# EAGLE schematic Main board V5.0 (EAGLE 6.5.0)

## Sheet 1 of 7: ACS
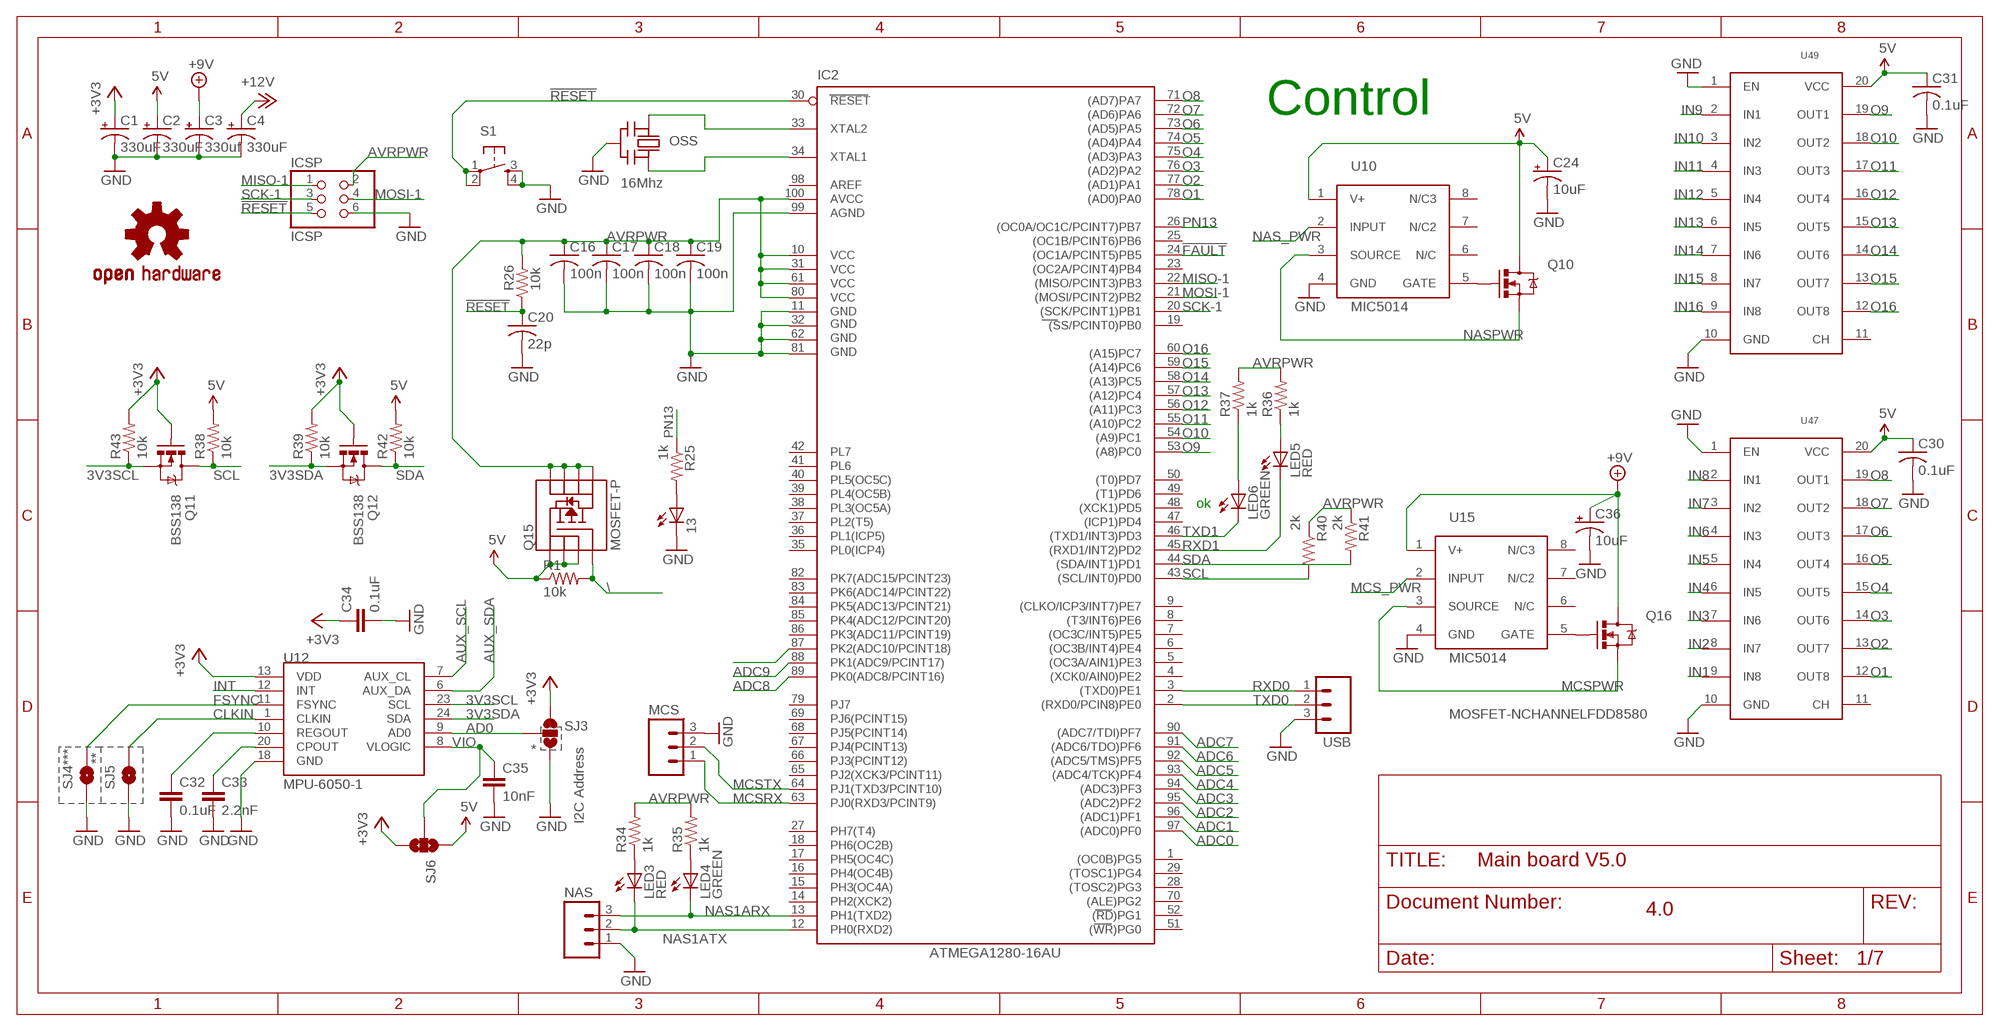
[diagram p0: schematic, sheet 1]

### Parts
13  LEDCHIP-LED0805  [CHIP-LED0805]
C1  330uF  CPOL-US140CLH-0810  [140CLH-0810]
C2  330uF  CPOL-US140CLH-0810  [140CLH-0810]
C3  330uf  CPOL-US140CLH-0810  [140CLH-0810]
C4  330uF  CPOL-US140CLH-0810  [140CLH-0810]
C16  100n  C-USC0805  [C0805]
C17  100n  C-USC0805  [C0805]
C18  100n  C-USC0805  [C0805]
C19  100n  C-USC0805  [C0805]
C20  22p  C-USC0805  [C0805]
C24  10uF  CPOL-USCT6032  [CT6032]
C30  0.1uF  C-USC0805  [C0805]
C31  0.1uF  C-USC0805  [C0805]
C32  0.1uF  CAP0805  [0805]
C33  2.2nF  CAP0805  [0805]
C34  0.1uF  CAP0805  [0805]
C35  10nF  CAP0805  [0805]
C36  10uF  CPOL-USCT6032  [CT6032]
IC2  ATMEGA1280-16AU  [TQFP100]
ICSP  ICSP  PINHD-2X3  [2X03]
LED3  RED  LEDCHIP-LED0805  [CHIP-LED0805]
LED4  GREEN  LEDCHIP-LED0805  [CHIP-LED0805]
LED5  RED  LEDCHIP-LED0805  [CHIP-LED0805]
LED6  GREEN  LEDCHIP-LED0805  [CHIP-LED0805]
MCS  M03LOCK  [1X03_LOCK]
NAS  M03POLAR  [MOLEX-1X3]
OSS  16Mhz  CERMOSCILL-AWCSR  [AWCSR]
Q10  MOSFET-NCHANNELFDD8580  [DPAK]
Q11  BSS138  MOSFET-NCHANNELSMD  [SOT23-3]
Q12  BSS138  MOSFET-NCHANNELSMD  [SOT23-3]
Q15  MOSFET-P  MOSFET-PCHANNEL-SOIC8SOIC8  [SO08]
Q16  MOSFET-NCHANNELFDD8580  [DPAK]
R1  10k  R-US_R0805  [R0805]
R25  1k  R-US_R0805  [R0805]
R26  10k  R-US_R0805  [R0805]
R34  1k  R-US_R0805  [R0805]
R35  1k  R-US_R0805  [R0805]
R36  1k  R-US_R0805  [R0805]
R37  1k  R-US_R0805  [R0805]
R38  10k  R-US_R0805  [R0805]
R39  10k  R-US_R0805  [R0805]
R40  2k  R-US_R0805  [R0805]
R41  2k  R-US_R0805  [R0805]
R42  10k  R-US_R0805  [R0805]
R43  10k  R-US_R0805  [R0805]
S1  TAC_SWITCHSMD  [TACTILE_SWITCH_SMD]
SJ3  SOLDERJUMPER_2WAYPASTE2&3  [SJ_3_PASTE2&3]
SJ4  SOLDERJUMPERTRACE  [SJ_2S-TRACE]
SJ5  SOLDERJUMPERTRACE  [SJ_2S-TRACE]
SJ6  SOLDERJUMPER_2WAYPASTE2&3  [SJ_3_PASTE2&3]
U10  MIC5014  [SO08]
U12  MPU-6050-1  [QFN-24-4MM2]
U15  MIC5014  [SO08]
U47  MAX6818  [SSOP-20]
U49  MAX6818  [SSOP-20]
U$3  OSHW-LOGOL  [OSHW-LOGO-L]
USB  M03LOCK  [1X03_LOCK]

### Nets
3V3SCL: Q11.2(S) R43.1 U12.23(SCL)
3V3SDA: Q12.2(S) R39.1 U12.24(SDA)
5V: C2.+ C24.+ C30.1 C31.1 Q10.4(D) Q15.1(S) Q15.2(S) Q15.3(S) R1.1 R38.2 R42.2 SJ6.1 U10.1(V+) U47.20(VCC) U49.20(VCC) ; also sheet 2,3,4,7
!FAULT: IC2.24((OC1A/PCINT5)PB5)
!RESET: C20.1 IC2.30(RESET) ICSP.5 R26.1 S1.1 S1.2
+3V3: C1.+ C34.1 Q11.1(G) Q12.1(G) R39.2 R43.2 SJ3.1 SJ6.3 U12.13(VDD) ; also sheet 4,6,7
+9V: C3.+ C36.+ Q16.4(D) U15.1(V+) ; also sheet 7
+12V: C4.+ ; also sheet 2,7
\: Q15.4(G) R1.2 ; also sheet 3
AD0: SJ3.2 U12.9(AD0)
ADC0: IC2.97((ADC0)PF0) ; also sheet 7
ADC1: IC2.96((ADC1)PF1) ; also sheet 7
ADC2: IC2.95((ADC2)PF2) ; also sheet 7
ADC3: IC2.94((ADC3)PF3) ; also sheet 7
ADC4: IC2.93((ADC4/TCK)PF4) ; also sheet 7
ADC5: IC2.92((ADC5/TMS)PF5) ; also sheet 7
ADC6: IC2.91((ADC6/TDO)PF6) ; also sheet 7
ADC7: IC2.90((ADC7/TDI)PF7) ; also sheet 7
ADC8: IC2.89(PK0(ADC8/PCINT16)) ; also sheet 7
ADC9: IC2.88(PK1(ADC9/PCINT17)) ; also sheet 7
AUX_SCL: U12.7(AUX_CL)
AUX_SDA: U12.6(AUX_DA)
AVRPWR: C16.1 C17.1 C18.1 C19.1 IC2.10(VCC) IC2.31(VCC1) IC2.61(VCC2) IC2.80(VCC3) IC2.100(AVCC) ICSP.2 Q15.5(D) Q15.6(D) Q15.7(D) Q15.8(D) R26.2 R34.2 R35.2 R36.2 R37.2 R40.1 R41.1
CLKIN: SJ5.2 U12.1(CLKIN)
FSYNC: SJ4.2 U12.11(FSYNC)
GND: 13.C C1.- C2.- C3.- C4.- C16.2 C17.2 C18.2 C19.2 C20.2 C24.- C30.2 C31.2 C32.2 C33.2 C34.2 C35.2 C36.- IC2.11(GND) IC2.32(GND1) IC2.62(GND2) IC2.81(GND3) IC2.99(AGND) ICSP.6 MCS.3 NAS.1 OSS.2(GND) S1.3 S1.4 SJ3.3 SJ4.1 SJ5.1 U10.4(GND) U12.18(GND) U15.4(GND) U47.1(EN) U47.10(GND) U49.1(EN) U49.10(GND) USB.3 ; also sheet 2,3,4,6,7
IN1: U47.9(IN8) ; also sheet 7
IN2: U47.8(IN7) ; also sheet 7
IN3: U47.7(IN6) ; also sheet 7
IN4: U47.6(IN5) ; also sheet 7
IN5: U47.5(IN4) ; also sheet 7
IN6: U47.4(IN3) ; also sheet 7
IN7: U47.3(IN2) ; also sheet 7
IN8: U47.2(IN1) ; also sheet 7
IN9: U49.2(IN1) ; also sheet 7
IN10: U49.3(IN2) ; also sheet 7
IN11: U49.4(IN3) ; also sheet 7
IN12: U49.5(IN4) ; also sheet 7
IN13: U49.6(IN5) ; also sheet 7
IN14: U49.7(IN6) ; also sheet 7
IN15: U49.8(IN7) ; also sheet 7
IN16: U49.9(IN8) ; also sheet 7
INT: U12.12(INT)
MCS_PWR: U15.2(INPUT) ; also sheet 3
MCSPWR: Q16.3(S) U15.3(SOURCE) ; also sheet 7
MCSRX: IC2.63(PJ0(RXD3/PCINT9)) MCS.1 ; also sheet 5,7
MCSTX: IC2.64(PJ1(TXD3/PCINT10)) MCS.2 ; also sheet 5,7
MISO-1: IC2.22((MISO/PCINT3)PB3) ICSP.1
MOSI-1: IC2.21((MOSI/PCINT2)PB2) ICSP.4
N$2: 13.A R25.2
N$6: IC2.34(XTAL1) OSS.3(OUT)
N$7: IC2.33(XTAL2) OSS.1(IN)
N$13: C33.1 U12.20(CPOUT)
N$14: C32.1 U12.10(REGOUT)
N$20: IC2.87(PK2(ADC10/PCINT18))
N$52: Q10.1(G) U10.5(GATE)
N$69: LED4.A R35.1
N$71: LED3.A R34.1
N$74: LED6.A R37.1
N$75: LED5.A R36.1
N$107: Q16.1(G) U15.5(GATE)
NAS1ARX: IC2.13(PH1(TXD2)) LED4.C NAS.3 ; also sheet 4
NAS1ATX: IC2.12(PH0(RXD2)) LED3.C NAS.2 ; also sheet 4
NAS_PWR: U10.2(INPUT) ; also sheet 3
NASPWR: Q10.3(S) U10.3(SOURCE) ; also sheet 7
O1: IC2.78((AD0)PA0) U47.12(OUT8)
O2: IC2.77((AD1)PA1) U47.13(OUT7)
O3: IC2.76((AD2)PA2) U47.14(OUT6)
O4: IC2.75((AD3)PA3) U47.15(OUT5)
O5: IC2.74((AD4)PA4) U47.16(OUT4)
O6: IC2.73((AD5)PA5) U47.17(OUT3)
O7: IC2.72((AD6)PA6) U47.18(OUT2)
O8: IC2.71((AD7)PA7) U47.19(OUT1)
O9: IC2.53((A8)PC0) U49.19(OUT1)
O10: IC2.54((A9)PC1) U49.18(OUT2)
O11: IC2.55((A10)PC2) U49.17(OUT3)
O12: IC2.56((A11)PC3) U49.16(OUT4)
O13: IC2.57((A12)PC4) U49.15(OUT5)
O14: IC2.58((A13)PC5) U49.14(OUT6)
O15: IC2.59((A14)PC6) U49.13(OUT7)
O16: IC2.60((A15)PC7) U49.12(OUT8)
PN13: IC2.26((OC0A/OC1C/PCINT7)PB7) R25.1 ; also sheet 3
RXD0: IC2.3((TXD0)PE1) USB.1
RXD1: IC2.45((RXD1/INT2)PD2) LED5.C ; also sheet 4
SCK-1: IC2.20((SCK/PCINT1)PB1) ICSP.3
SCL: IC2.43((SCL/INT0)PD0) Q11.3(D) R38.1 R40.2 ; also sheet 2
SDA: IC2.44((SDA/INT1)PD1) Q12.3(D) R41.2 R42.1 ; also sheet 2
TXD0: IC2.2((RXD0/PCIN8)PE0) USB.2
TXD1: IC2.46((TXD1/INT3)PD3) LED6.C ; also sheet 4
VIO: C35.1 SJ6.2 U12.8(VLOGIC)
Unconnected: IC2.1((OC0B)PG5) IC2.4((XCK0/AIN0)PE2) IC2.5((OC3A/AIN1)PE3) IC2.6((OC3B/INT4)PE4) IC2.7((OC3C/INT5)PE5) IC2.8((T3/INT6)PE6) IC2.9((CLKO/ICP3/INT7)PE7) IC2.14(PH2(XCK2)) IC2.15(PH3(OC4A)) IC2.16(PH4(OC4B)) IC2.17(PH5(OC4C)) IC2.18(PH6(OC2B)) IC2.19((SS/PCINT0)PB0) IC2.23((OC2A/PCINT4)PB4) IC2.25((OC1B/PCINT6)PB6) IC2.27(PH7(T4)) IC2.28((TOSC2)PG3) IC2.29((TOSC1)PG4) IC2.35(PL0(ICP4)) IC2.36(PL1(ICP5)) IC2.37(PL2(T5)) IC2.38(PL3(OC5A)) IC2.39(PL4(OC5B)) IC2.40(PL5(OC5C)) IC2.41(PL6) IC2.42(PL7) IC2.47((ICP1)PD4) IC2.48((XCK1)PD5) IC2.49((T1)PD6) IC2.50((T0)PD7) IC2.51((WR)PG0) IC2.52((RD)PG1) IC2.65(PJ2(XCK3/PCINT11)) IC2.66(PJ3(PCINT12)) IC2.67(PJ4(PCINT13)) IC2.68(PJ5(PCINT14)) IC2.69(PJ6(PCINT15)) IC2.70((ALE)PG2) IC2.79(PJ7) IC2.82(PK7(ADC15/PCINT23)) IC2.83(PK6(ADC14/PCINT22)) IC2.84(PK5(ADC13/PCINT21)) IC2.85(PK4(ADC12/PCINT20)) IC2.86(PK3(ADC11/PCINT19)) IC2.98(AREF) U10.6(N/C) U10.7(N/C2) U10.8(N/C3) U15.6(N/C) U15.7(N/C2) U15.8(N/C3) U47.11(CH) U49.11(CH)

### Notes on the sheet
- Control
- ok
- * | I2C Address
- *** | **
- 4.0

## Sheet 2 of 7: LCS
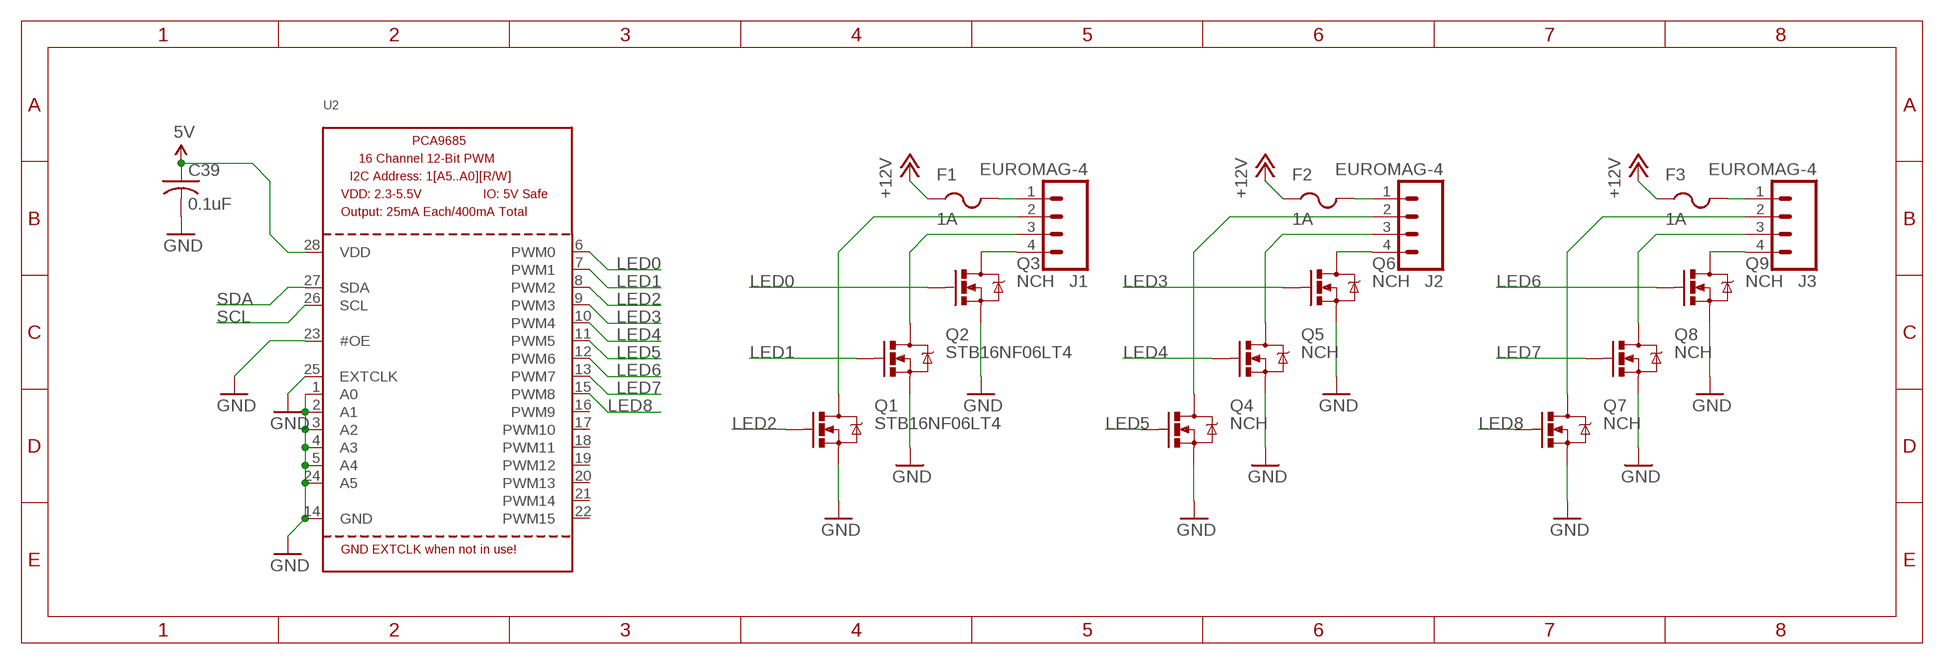
[diagram p1: schematic, sheet 2]

### Parts
C39  0.1uF  C-USC0603  [C0603]
F1  1A  PTCFUSE-1812  [1812]
F2  1A  PTCFUSE-1812  [1812]
F3  1A  PTCFUSE-1812  [1812]
J1  EUROMAG-4  [M4]
J2  EUROMAG-4  [M4]
J3  EUROMAG-4  [M4]
Q1  STB16NF06LT4  MOSFET-NCHANNELFDD8580  [DPAK]
Q2  STB16NF06LT4  MOSFET-NCHANNELFDD8580  [DPAK]
Q3  NCH  MOSFET-NCHANNELFDD8580  [DPAK]
Q4  NCH  MOSFET-NCHANNELFDD8580  [DPAK]
Q5  NCH  MOSFET-NCHANNELFDD8580  [DPAK]
Q6  NCH  MOSFET-NCHANNELFDD8580  [DPAK]
Q7  NCH  MOSFET-NCHANNELFDD8580  [DPAK]
Q8  NCH  MOSFET-NCHANNELFDD8580  [DPAK]
Q9  NCH  MOSFET-NCHANNELFDD8580  [DPAK]
U2  PCA9685  [TSSOP28]

### Nets
5V: C39.1 U2.28(VDD) ; also sheet 1,3,4,7
+12V: F1.1 F2.1 F3.1 ; also sheet 1,7
GND: C39.2 Q1.3(S) Q2.3(S) Q3.3(S) Q4.3(S) Q5.3(S) Q6.3(S) Q7.3(S) Q8.3(S) Q9.3(S) U2.1(A0) U2.2(A1) U2.3(A2) U2.4(A3) U2.5(A4) U2.14(GND) U2.23(#OE) U2.24(A5) U2.25(EXTCLK) ; also sheet 1,3,4,6,7
LED0: Q3.1(G) U2.6(PWM0)
LED1: Q2.1(G) U2.7(PWM1)
LED2: Q1.1(G) U2.8(PWM2)
LED3: Q6.1(G) U2.9(PWM3)
LED4: Q5.1(G) U2.10(PWM4)
LED5: Q4.1(G) U2.11(PWM5)
LED6: Q9.1(G) U2.12(PWM6)
LED7: Q8.1(G) U2.13(PWM7)
LED8: Q7.1(G) U2.15(PWM8)
N$22: J1.4 Q3.4(D)
N$28: J1.3 Q2.4(D)
N$29: J1.2 Q1.4(D)
N$30: F1.2 J1.1
N$31: J2.4 Q6.4(D)
N$32: J2.3 Q5.4(D)
N$34: J2.2 Q4.4(D)
N$35: F2.2 J2.1
N$36: J3.4 Q9.4(D)
N$37: J3.3 Q8.4(D)
N$38: J3.2 Q7.4(D)
N$39: F3.2 J3.1
SCL: U2.26(SCL) ; also sheet 1
SDA: U2.27(SDA) ; also sheet 1
Unconnected: U2.16(PWM9) U2.17(PWM10) U2.18(PWM11) U2.19(PWM12) U2.20(PWM13) U2.21(PWM14) U2.22(PWM15)

## Sheet 3 of 7: WDS
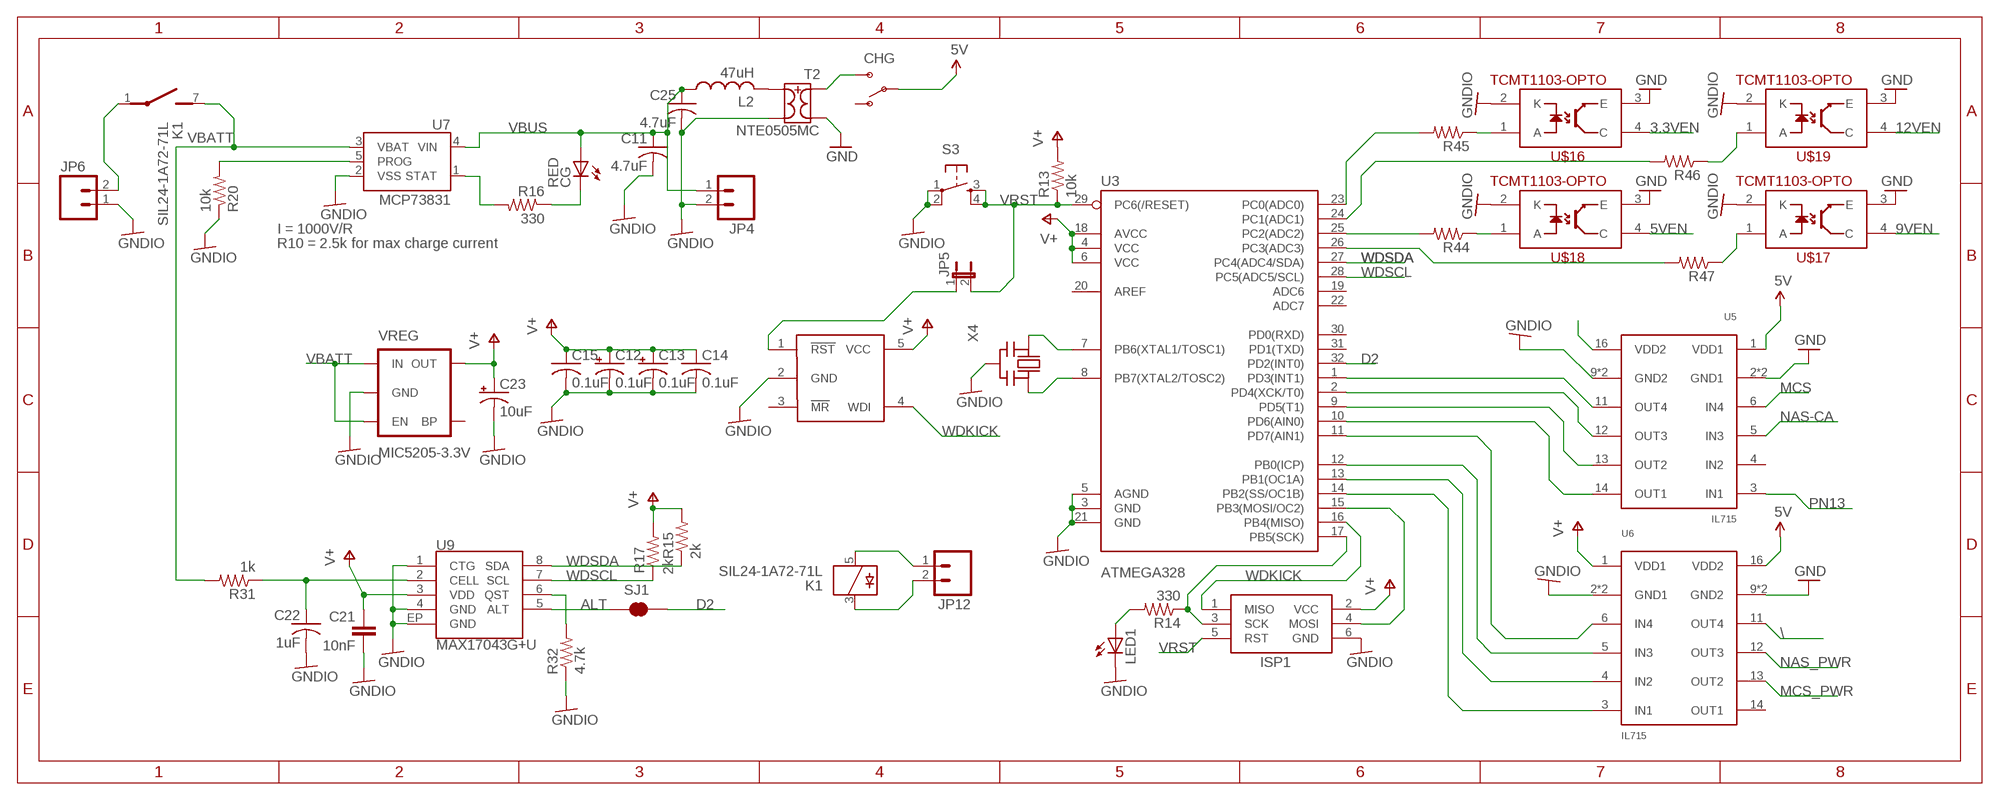
[diagram p2: schematic, sheet 3]

### Parts
C11  4.7uF  C-USC0603  [C0603]
C12  0.1uF  CPOL-USCT3528  [CT3528]
C13  0.1uF  CPOL-USCT3528  [CT3528]
C14  0.1uF  C-USC0805  [C0805]
C15  0.1uF  C-USC0805  [C0805]
C21  10nF  CAP0603-CAP  [0603-CAP]
C22  1uF  C-USC0603  [C0603]
C23  10uF  CPOL-USCT3528  [CT3528]
C25  4.7uF  C-USC0603  [C0603]
CG  RED  LEDSML0805  [SML0805]
CHG  SWITCH-SPSTPTH  [SWITCH-SPDT]
ISP1  AVRISP-6  [AVRISP]
JP4  M021X02_NO_SILK  [1X02_NO_SILK]
JP5  JUMPER-2PTH_LOCK  [1X02_LOCK]
JP6  M02-JST-2MM-SMT  [JST-2-SMD]
JP12  M02POLAR_LOCK  [MOLEX-1X2_LOCK]
K1  SIL24-1A72-71L  35701331  [REED]
L2  47uH  L-USL2012C  [L2012C]
LED1  LEDCHIPLED_0805  [CHIPLED_0805]
R13  10k  R-US_R0805  [R0805]
R14  330  R-US_R0805  [R0805]
R15  2k  R-US_R0805  [R0805]
R16  330  R-US_R0805  [R0805]
R17  2k  R-US_R0805  [R0805]
R20  10k  R-US_R0805  [R0805]
R31  1k  R-US_R0805  [R0805]
R32  4.7k  R-US_R0805  [R0805]
R44  R-US_R0805  [R0805]
R45  R-US_R0805  [R0805]
R46  R-US_R0805  [R0805]
R47  R-US_R0805  [R0805]
S3  TAC_SWITCHPTH  [TACTILE-PTH]
SJ1  SOLDERJUMPERTRACE  [SJ_2S-TRACE]
T2  NTE0505MC  [SO-8FT]
U3  ATMEGA328  ATMEGA168  [TQFP32-08]
U5  IL715  [S016]
U6  IL715  [S016]
U7  MCP73831  [SOT23-5]
U9  MAX17043G+U  MAX1704X  [TDFN-8]
U20  MAX823  [SOT23-5L]
U$16  TCMT1103-OPTO  [SSOP-4]
U$17  TCMT1103-OPTO  [SSOP-4]
U$18  TCMT1103-OPTO  [SSOP-4]
U$19  TCMT1103-OPTO  [SSOP-4]
VREG  MIC5205-3.3V  V_REG_LDOSMD  [SOT23-5]
X4  CERMOSCILL-AWCSR  [AWCSR]

### Nets
3.3VEN: U$16.4(C) ; also sheet 7
5V: CHG.2(P) U5.1(VDD1) U6.16(VDD2) ; also sheet 1,2,4,7
5VEN: U$18.4(C) ; also sheet 7
9VEN: U$17.4(C) ; also sheet 7
12VEN: U$19.4(C) ; also sheet 7
\: U6.11(OUT4) ; also sheet 1
ALT: SJ1.1 U9.5(ALT)
CELL: C22.1 R31.1 U9.2(CELL)
D2: SJ1.2 U3.32(PD2(INT0))
GND: T2.1 U5.2(GND1) U5.8(GND1) U6.9(GND2) U6.15(GND2) U$16.3(E) U$17.3(E) U$18.3(E) U$19.3(E) ; also sheet 1,2,4,6,7
GNDIO: C11.2 C12.- C13.- C14.2 C15.2 C21.2 C22.2 C23.- C25.2 ISP1.6(GND) JP4.2 JP6.1 LED1.C R20.1 R32.1 S3.1 S3.2 T2.7 U3.3(GND) U3.5(AGND) U3.21(GND) U5.9(GND2) U5.15(GND2) U6.2(GND1) U6.8(GND1) U7.2(VSS) U9.1(CTG) U9.4(GND) U9.EP(GND) U20.2(GND) U$16.2(K) U$17.2(K) U$18.2(K) U$19.2(K) VREG.2(GND) X4.2(GND)
MCS: U5.6(IN4) ; also sheet 7
MCS_PWR: U6.13(OUT2) ; also sheet 1
N$18: JP5.1 U20.1(!RST)
N$19: ISP1.3(SCK) R14.1 U3.17(PB5(SCK))
N$27: ISP1.4(MOSI) U3.15(PB3(MOSI/OC2))
N$33: R45.2 U3.23(PC0(ADC0))
N$40: L2.2 T2.8
N$42: LED1.A R14.2
N$44: CG.C R16.1
N$45: JP12.1 K1.5
N$46: JP6.2 K1.1(2:P)
N$47: U3.7(PB6(XTAL1/TOSC1)) X4.1(IN)
N$48: U3.8(PB7(XTAL2/TOSC2)) X4.3(OUT)
N$49: U3.2(PD4(XCK/T0)) U5.12(OUT3)
N$50: U3.9(PD5(T1)) U5.13(OUT2)
N$51: U3.10(PD6(AIN0)) U5.14(OUT1)
N$59: CHG.3(S) T2.3
N$72: U3.11(PD7(AIN1)) U6.6(IN4)
N$76: U3.1(PD3(INT1)) U5.11(OUT4)
N$77: R45.1 U$16.1(A)
N$78: R46.2 U3.24(PC1(ADC1))
N$79: U3.12(PB0(ICP)) U6.5(IN3)
N$80: U3.13(PB1(OC1A)) U6.4(IN2)
N$81: U3.14(PB2(SS/OC1B)) U6.3(IN1)
N$82: R46.1 U$19.1(A)
N$83: R44.2 U3.25(PC2(ADC2))
N$84: R44.1 U$18.1(A)
N$85: R47.2 U3.26(PC3(ADC3))
N$86: R47.1 U$17.1(A)
N$91: JP12.2 K1.3
N$94: U5.16(VDD2)
NAS-CA: U5.5(IN3) ; also sheet 7
NAS_PWR: U6.12(OUT3) ; also sheet 1
PN13: U5.3(IN1) ; also sheet 1
PROG: R20.2 U7.5(PROG)
QST: R32.2 U9.6(QST)
STAT: R16.2 U7.1(STAT)
V+: C12.+ C13.+ C14.1 C15.1 C21.1 C23.+ ISP1.2(VCC) R13.2 R15.2 R17.2 U3.4(VCC) U3.6(VCC) U3.18(AVCC) U6.1(VDD1) U9.3(VDD) U20.5(VCC) VREG.5(OUT)
VBATT: K1.7(2:S) R31.2 U7.3(VBAT) VREG.1(IN) VREG.3(EN)
VBUS: C11.1 C25.1 CG.A JP4.1 L2.1 U7.4(VIN)
VRST: ISP1.5(RST) JP5.2 R13.1 S3.3 S3.4 U3.29(PC6(/RESET))
WDKICK: ISP1.1(MISO) U3.16(PB4(MISO)) U20.4(WDI)
WDSCL: R17.1 U3.28(PC5(ADC5/SCL)) U9.7(SCL)
WDSDA: R15.1 U3.27(PC4(ADC4/SDA)) U9.8(SDA)
Unconnected: CHG.1(O) U3.19(ADC6) U3.20(AREF) U3.22(ADC7) U3.30(PD0(RXD)) U3.31(PD1(TXD)) U5.4(IN2) U6.14(OUT1) U20.3(!MR) VREG.4(BP)

### Notes on the sheet
- I = 1000V/R
- R10 = 2.5k for max charge current

## Sheet 4 of 7: CTS
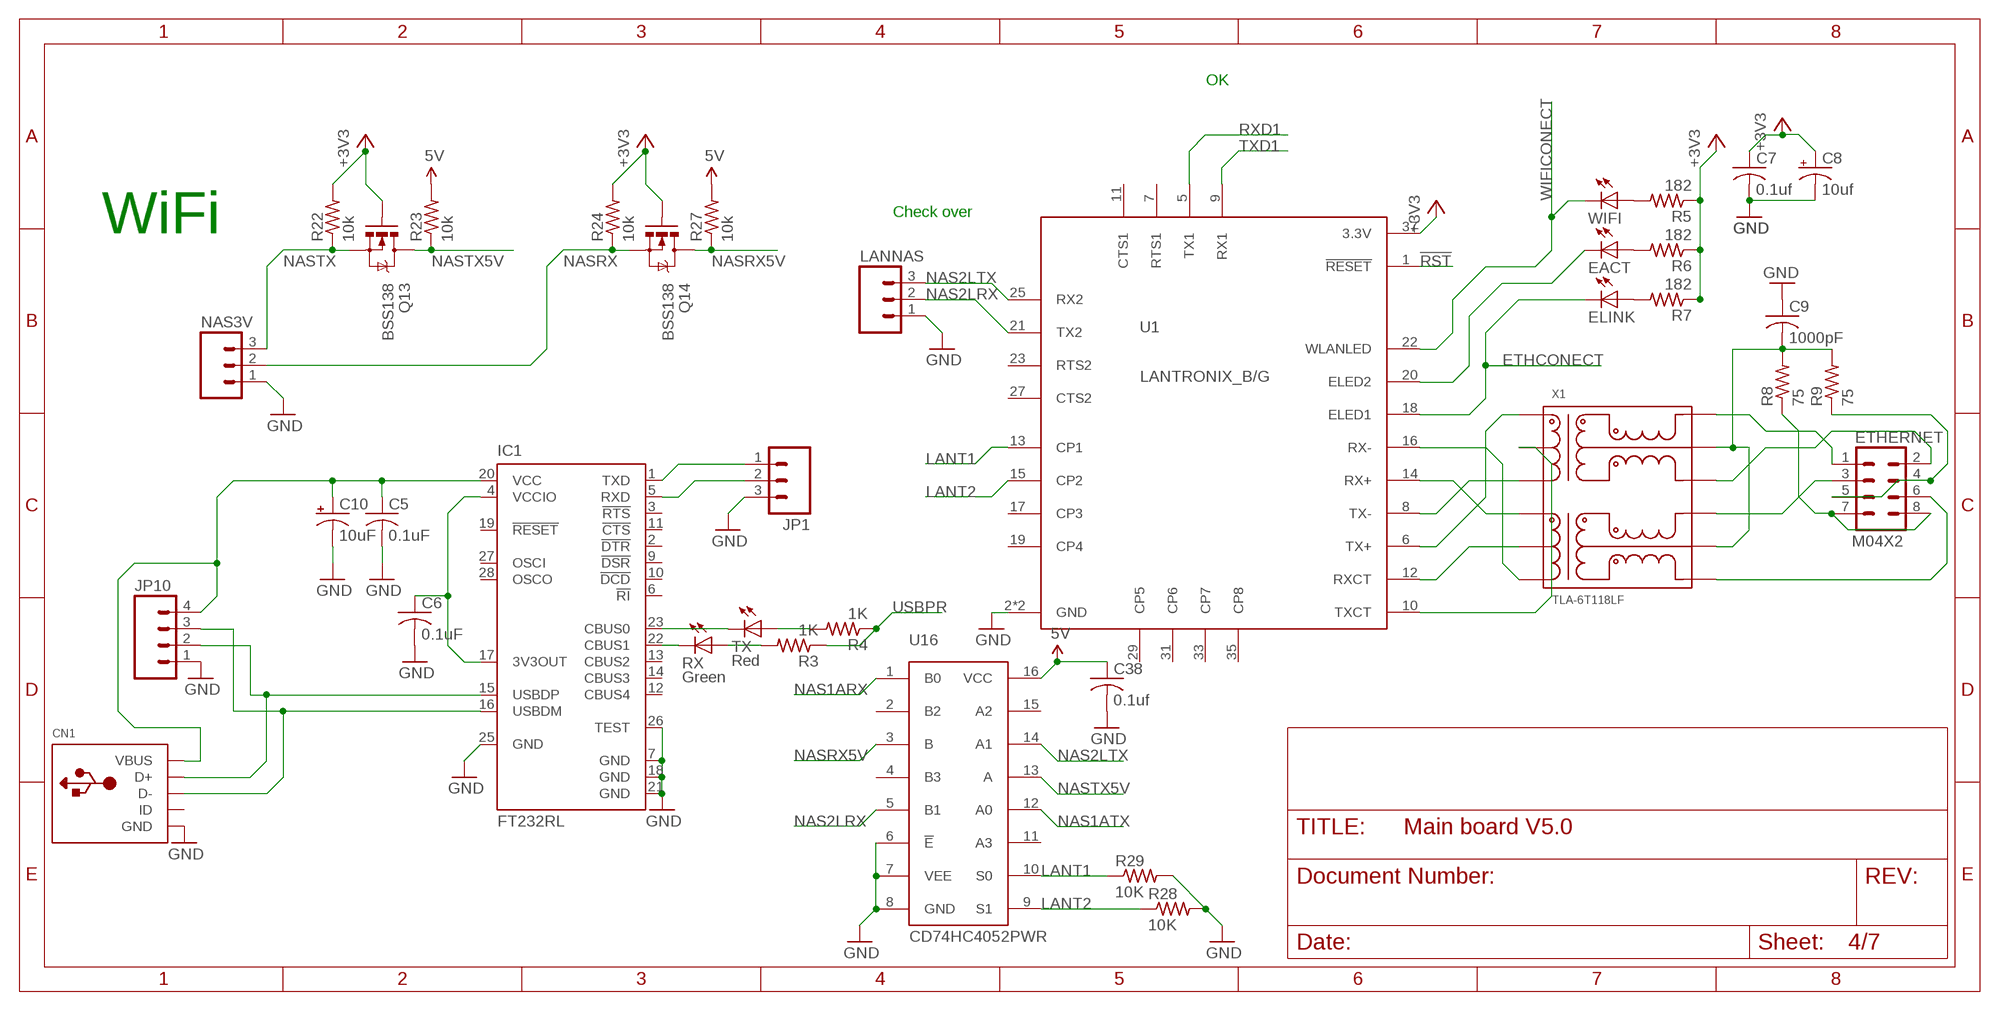
[diagram p3: schematic, sheet 4]

### Parts
C5  0.1uF  C-USC0805K  [C0805K]
C6  0.1uF  C-USC0805K  [C0805K]
C7  0.1uf  C-USC0805K  [C0805K]
C8  10uf  CAP_POL3528  [EIA3528]
C9  1000pF  C-USC1812  [C1812]
C10  10uF  CAP_POL3528-KIT  [EIA3528-KIT]
C38  0.1uf  C-USC0805K  [C0805K]
CN1  USBMINIB  [USB-MINIB]
EACT  LEDCHIP-LED0805  [CHIP-LED0805]
ELINK  LEDCHIP-LED0805  [CHIP-LED0805]
ETHERNET  M04X2  [2X4]
IC1  FT232RL  [SSOP28]
JP1  M03POLAR  [MOLEX-1X3]
JP10  M04POLAR  [MOLEX-1X4]
LANNAS  M03POLAR  [MOLEX-1X3]
NAS3V  M03LOCK_NO_SILK  [1X03_LOCK_NO_SILK]
Q13  BSS138  MOSFET-NCHANNELSMD  [SOT23-3]
Q14  BSS138  MOSFET-NCHANNELSMD  [SOT23-3]
R3  1K  R-US_R0805  [R0805]
R4  1K  R-US_R0805  [R0805]
R5  182  R-US_R0805  [R0805]
R6  182  R-US_R0805  [R0805]
R7  182  R-US_R0805  [R0805]
R8  75  R-US_R0805  [R0805]
R9  75  R-US_R0805  [R0805]
R22  10k  R-US_R0805  [R0805]
R23  10k  R-US_R0805  [R0805]
R24  10k  R-US_R0805  [R0805]
R27  10k  R-US_R0805  [R0805]
R28  10K  R-US_R0805  [R0805]
R29  10K  R-US_R0805  [R0805]
RX  Green  LEDCHIP-LED0805  [CHIP-LED0805]
TX  Red  LEDCHIP-LED0805  [CHIP-LED0805]
U1  LANTRONIX_B/G  LANTRONIX_A/B  [LANA/BTH]
U16  CD74HC4052PWR  [TSSOP-16]
WIFI  LEDCHIP-LED0805  [CHIP-LED0805]
X1  TLA-6T118LF  [SO-16MOD]

### Nets
5V: C38.1 R23.2 R27.2 U16.16(VCC) ; also sheet 1,2,3,7
!RST: U1.1(!RESET)
+3V3: C7.1 C8.A(+) Q13.1(G) Q14.1(G) R5.1 R6.1 R7.1 R22.2 R24.2 U1.37(3.3V) ; also sheet 1,6,7
ETHCONECT: ELINK.C U1.18(ELED1)
GND: C5.2 C6.2 C7.2 C8.C(-) C9.1 C10.C(-) C38.2 CN1.GND IC1.7(GND) IC1.18(GND) IC1.21(GND) IC1.25(GND) IC1.26(TEST) JP1.3 JP10.1 LANNAS.1 NAS3V.1 R28.2 R29.2 U1.2(GND) U1.39(GND) U16.6(!E) U16.7(VEE) U16.8(GND) ; also sheet 1,2,3,6,7
LANT1: R29.1 U1.13(CP1) U16.10(S0)
LANT2: R28.1 U1.15(CP2) U16.9(S1)
N$1: IC1.23(CBUS0) TX.C
N$3: IC1.22(CBUS1) RX.C
N$4: R3.2 RX.A
N$5: CN1.D+ IC1.15(USBDP) JP10.2
N$8: CN1.D- IC1.16(USBDM) JP10.3
N$9: R4.2 TX.A
N$11: IC1.1(TXD) JP1.1
N$12: C6.1 IC1.4(VCCIO) IC1.17(3V3OUT)
N$53: U1.8(TX-) X1.3
N$54: U1.6(TX+) X1.1
N$55: U1.14(RX+) X1.6
N$56: U1.16(RX-) X1.8
N$57: U1.12(RXCT) X1.7
N$58: U1.10(TXCT) X1.2
N$60: ETHERNET.4 ETHERNET.5 R9.1
N$61: ETHERNET.6 X1.9
N$62: ETHERNET.3 ETHERNET.7 ETHERNET.8 R8.1 X1.11
N$63: ETHERNET.2 X1.14
N$64: ETHERNET.1 X1.16
N$65: C9.2 R8.2 R9.2 X1.10 X1.15
N$66: ELINK.A R7.2
N$67: EACT.A R6.2
N$68: R5.2 WIFI.A
N$70: EACT.C U1.20(ELED2)
N$109: IC1.5(RXD) JP1.2
NAS1ARX: U16.1(B0) ; also sheet 1
NAS1ATX: U16.12(A0) ; also sheet 1
NAS2LRX: LANNAS.2 U1.21(TX2) U16.5(B1)
NAS2LTX: LANNAS.3 U1.25(RX2) U16.14(A1)
NASRX: NAS3V.2 Q14.2(S) R24.1 ; also sheet 7
NASRX5V: Q14.3(D) R27.1 U16.3(B)
NASTX: NAS3V.3 Q13.2(S) R22.1 ; also sheet 7
NASTX5V: Q13.3(D) R23.1 U16.13(A)
RXD1: U1.5(TX1) ; also sheet 1
TXD1: U1.9(RX1) ; also sheet 1
USBPR: C5.1 C10.A(+) CN1.VBUS IC1.20(VCC) JP10.4 R3.1 R4.1
WIFICONECT: U1.22(WLANLED) WIFI.C
Unconnected: CN1.ID IC1.2(!DTR) IC1.3(!RTS) IC1.6(!RI) IC1.9(!DSR) IC1.10(!DCD) IC1.11(!CTS) IC1.12(CBUS4) IC1.13(CBUS2) IC1.14(CBUS3) IC1.19(!RESET) IC1.27(OSCI) IC1.28(OSCO) U1.7(RTS1) U1.11(CTS1) U1.17(CP3) U1.19(CP4) U1.23(RTS2) U1.27(CTS2) U1.29(CP5) U1.31(CP6) U1.33(CP7) U1.35(CP8) U16.2(B2) U16.4(B3) U16.11(A3) U16.15(A2)

### Notes on the sheet
- OK
- Check over
- WiFi

## Sheet 5 of 7: RS485TOUSB
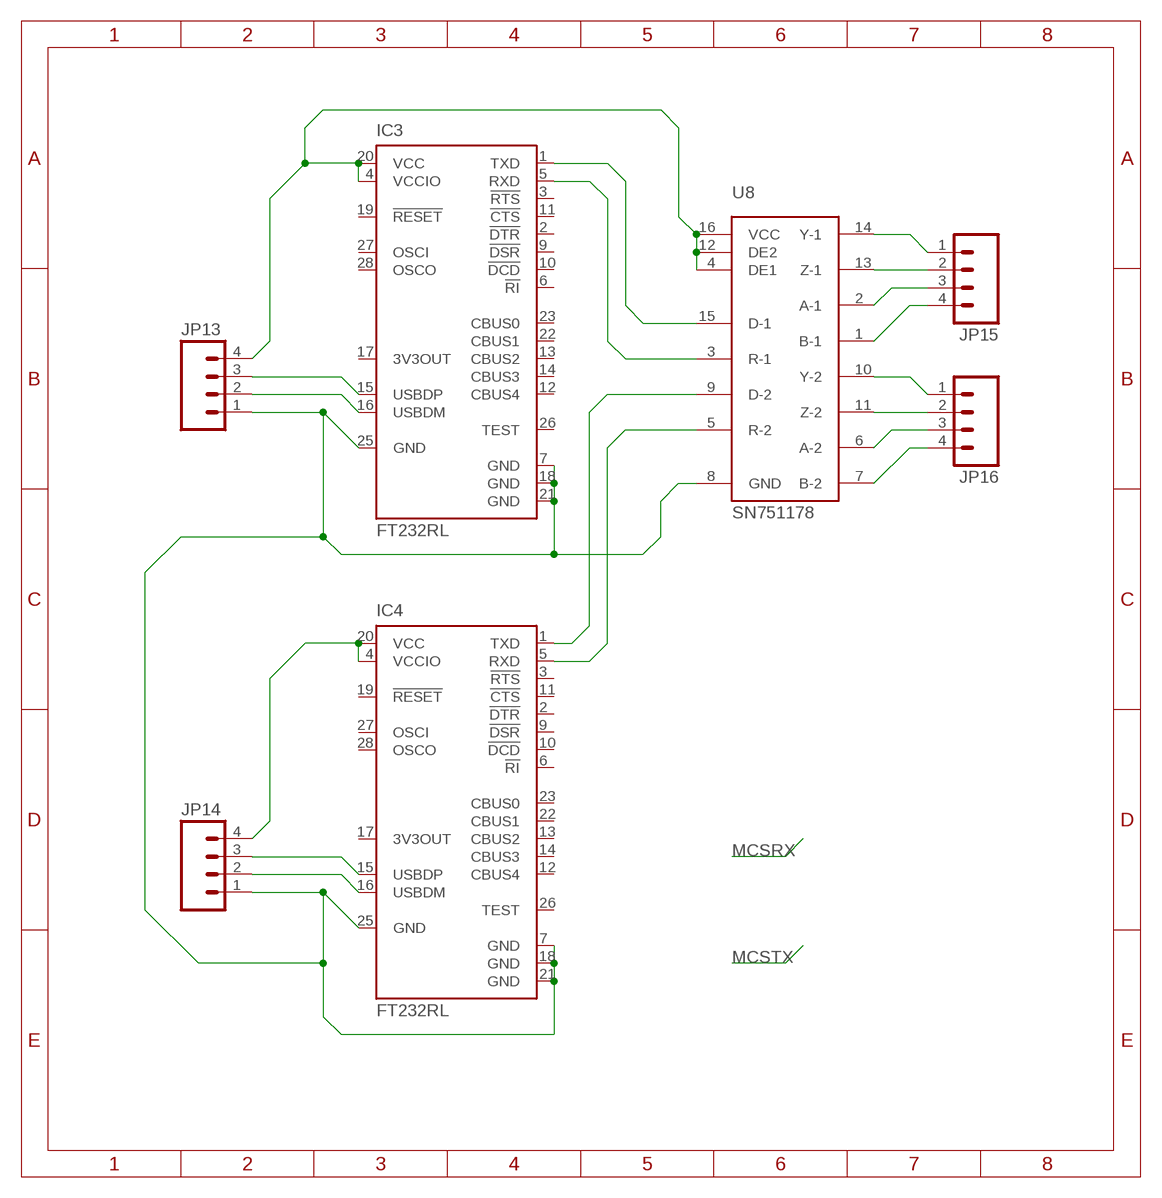
[diagram p4: schematic, sheet 5]

### Parts
IC3  FT232RL  [SSOP28]
IC4  FT232RL  [SSOP28]
JP13  M04SMD  [1X04-SMD]
JP14  M04SMD  [1X04-SMD]
JP15  M04SMD  [1X04-SMD]
JP16  M04SMD  [1X04-SMD]
U8  SN751178  [S016]

### Nets
N$73: IC4.1(TXD) U8.9(D-2)
N$87: IC3.15(USBDP) JP13.3
N$88: IC3.16(USBDM) JP13.2
N$89: IC3.1(TXD) U8.15(D-1)
N$90: IC3.4(VCCIO) IC3.20(VCC) JP13.4 U8.4(DE1) U8.12(DE2) U8.16(VCC)
N$92: IC3.5(RXD) U8.3(R-1)
N$93: IC4.15(USBDP) JP14.3
N$95: IC4.16(USBDM) JP14.2
N$96: IC4.4(VCCIO) IC4.20(VCC) JP14.4
N$97: IC3.7(GND) IC3.18(GND) IC3.21(GND) IC3.25(GND) IC4.7(GND) IC4.18(GND) IC4.21(GND) IC4.25(GND) JP13.1 JP14.1 U8.8(GND)
N$98: IC4.5(RXD) U8.5(R-2)
N$99: JP15.1 U8.14(Y-1)
N$100: JP15.2 U8.13(Z-1)
N$101: JP15.3 U8.2(A-1)
N$102: JP15.4 U8.1(B-1)
N$103: JP16.1 U8.10(Y-2)
N$104: JP16.2 U8.11(Z-2)
N$105: JP16.3 U8.6(A-2)
N$106: JP16.4 U8.7(B-2)
Unconnected: IC3.2(!DTR) IC3.3(!RTS) IC3.6(!RI) IC3.9(!DSR) IC3.10(!DCD) IC3.11(!CTS) IC3.12(CBUS4) IC3.13(CBUS2) IC3.14(CBUS3) IC3.17(3V3OUT) IC3.19(!RESET) IC3.22(CBUS1) IC3.23(CBUS0) IC3.26(TEST) IC3.27(OSCI) IC3.28(OSCO) IC4.2(!DTR) IC4.3(!RTS) IC4.6(!RI) IC4.9(!DSR) IC4.10(!DCD) IC4.11(!CTS) IC4.12(CBUS4) IC4.13(CBUS2) IC4.14(CBUS3) IC4.17(3V3OUT) IC4.19(!RESET) IC4.22(CBUS1) IC4.23(CBUS0) IC4.26(TEST) IC4.27(OSCI) IC4.28(OSCO)

## Sheet 6 of 7
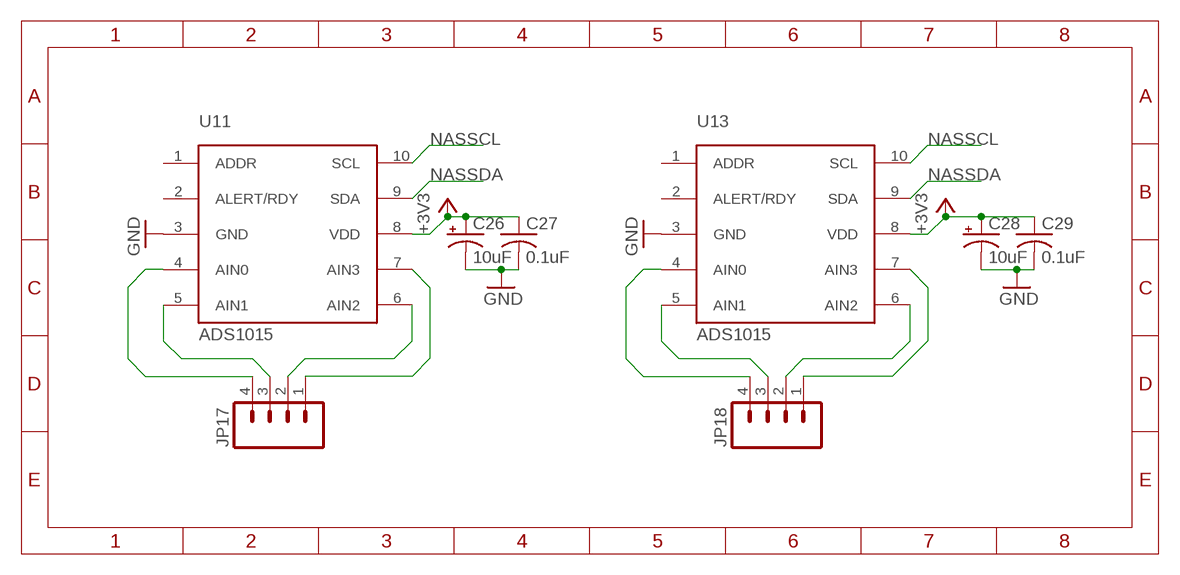
[diagram p5: schematic, sheet 6]

### Parts
C26  10uF  CAP_POL1206-KIT  [EIA3216-KIT]
C27  0.1uF  C-USC0805  [C0805]
C28  10uF  CAP_POL1206-KIT  [EIA3216-KIT]
C29  0.1uF  C-USC0805  [C0805]
JP17  M04POLAR  [MOLEX-1X4]
JP18  M04POLAR  [MOLEX-1X4]
U11  ADS1015  [MSOP-10]
U13  ADS1015  [MSOP-10]

### Nets
+3V3: C26.A(+) C27.1 C28.A(+) C29.1 U11.8(VDD) U13.8(VDD) ; also sheet 1,4,7
GND: C26.C(-) C27.2 C28.C(-) C29.2 U11.3(GND) U13.3(GND) ; also sheet 1,2,3,4,7
N$112: JP17.4 U11.4(AIN0)
N$113: JP17.3 U11.5(AIN1)
N$114: JP17.2 U11.6(AIN2)
N$115: JP17.1 U11.7(AIN3)
N$116: JP18.4 U13.4(AIN0)
N$117: JP18.3 U13.5(AIN1)
N$118: JP18.2 U13.6(AIN2)
N$119: JP18.1 U13.7(AIN3)
NASSCL: U11.10(SCL) U13.10(SCL) ; also sheet 7
NASSDA: U11.9(SDA) U13.9(SDA) ; also sheet 7
Unconnected: U11.1(ADDR) U11.2(ALERT/RDY) U13.1(ADDR) U13.2(ALERT/RDY)

## Sheet 7 of 7: connectors
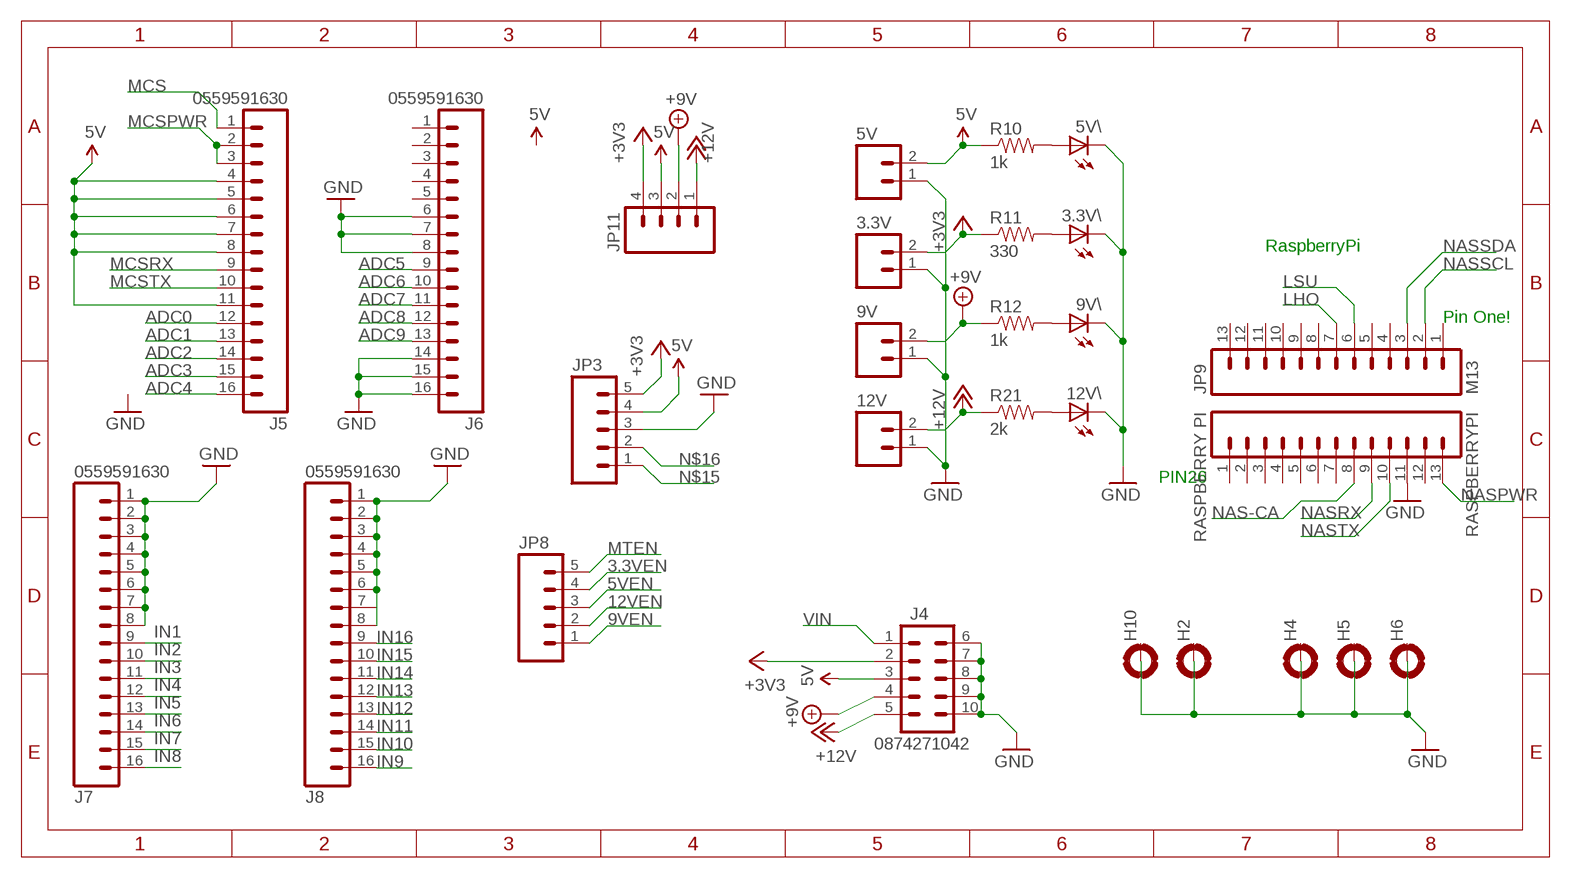
[diagram p6: schematic, sheet 7]

### Parts
3.3V  EUROMAG-290DEG  [M2]
3.3V\  LED-FKIT-1206  [FKIT-LED-1206]
5V  EUROMAG-290DEG  [M2]
5V\  LED-FKIT-1206  [FKIT-LED-1206]
9V  EUROMAG-290DEG  [M2]
9V\  LED-FKIT-1206  [FKIT-LED-1206]
12V  EUROMAG-290DEG  [M2]
12V\  LED-FKIT-1206  [FKIT-LED-1206]
H2  MOUNT-PAD-ROUND2.8  [2,8-PAD]
H4  MOUNT-PAD-ROUND2.8  [2,8-PAD]
H5  MOUNT-PAD-ROUND2.8  [2,8-PAD]
H6  MOUNT-PAD-ROUND2.8  [2,8-PAD]
H10  MOUNT-PAD-ROUND2.8  [2,8-PAD]
J4  0874271042  [0874271042]
J5  0559591630  [0559591630]
J6  0559591630  [0559591630]
J7  0559591630  [0559591630]
J8  0559591630  [0559591630]
JP3  M05LOCK_LONGPADS  [1X05_LOCK_LONGPADS]
JP8  M05LOCK_LONGPADS  [1X05_LOCK_LONGPADS]
JP9  M13  [1X13]
JP11  M04POLAR  [MOLEX-1X4]
R10  1k  RESISTOR0805-RES  [0805]
R11  330  RESISTOR0805-RES  [0805]
R12  1k  RESISTOR0805-RES  [0805]
R21  2k  RESISTOR0805-RES  [0805]
RASPBERRYPI  RASPBERRY PI  M13  [1X13]

### Nets
3.3VEN: JP8.4 ; also sheet 3
5V: 5V.2 J4.3 J5.4 J5.5 J5.6 J5.7 J5.8 J5.11 JP3.4 JP11.3 R10.1 ; also sheet 1,2,3,4
5VEN: JP8.3 ; also sheet 3
9VEN: JP8.1 ; also sheet 3
12VEN: JP8.2 ; also sheet 3
+3V3: 3.3V.2 J4.2 JP3.5 JP11.4 R11.1 ; also sheet 1,4,6
+9V: 9V.2 J4.4 JP11.2 R12.1 ; also sheet 1
+12V: 12V.2 J4.5 JP11.1 R21.1 ; also sheet 1,2
ADC0: J5.12 ; also sheet 1
ADC1: J5.13 ; also sheet 1
ADC2: J5.14 ; also sheet 1
ADC3: J5.15 ; also sheet 1
ADC4: J5.16 ; also sheet 1
ADC5: J6.9 ; also sheet 1
ADC6: J6.10 ; also sheet 1
ADC7: J6.11 ; also sheet 1
ADC8: J6.12 ; also sheet 1
ADC9: J6.13 ; also sheet 1
GND: 3.3V.1 3.3V\.C 5V.1 5V\.C 9V.1 9V\.C 12V.1 12V\.C H2.B2,8(MOUNT) H4.B2,8(MOUNT) H5.B2,8(MOUNT) H6.B2,8(MOUNT) H10.B2,8(MOUNT) J4.6 J4.7 J4.8 J4.9 J4.10 J6.6 J6.7 J6.8 J6.14 J6.15 J6.16 J7.1 J7.2 J7.3 J7.4 J7.5 J7.6 J7.7 J7.8 J8.1 J8.2 J8.3 J8.4 J8.5 J8.6 J8.8 JP3.3 RASPBERRYPI.11 ; also sheet 1,2,3,4,6
IN1: J7.9 ; also sheet 1
IN2: J7.10 ; also sheet 1
IN3: J7.11 ; also sheet 1
IN4: J7.12 ; also sheet 1
IN5: J7.13 ; also sheet 1
IN6: J7.14 ; also sheet 1
IN7: J7.15 ; also sheet 1
IN8: J7.16 ; also sheet 1
IN9: J8.16 ; also sheet 1
IN10: J8.15 ; also sheet 1
IN11: J8.14 ; also sheet 1
IN12: J8.13 ; also sheet 1
IN13: J8.12 ; also sheet 1
IN14: J8.11 ; also sheet 1
IN15: J8.10 ; also sheet 1
IN16: J8.9 ; also sheet 1
LHO: JP9.7
LSU: JP9.6
MCS: J5.1 ; also sheet 3
MCSPWR: J5.2 J5.3 ; also sheet 1
MCSRX: J5.9 ; also sheet 1,5
MCSTX: J5.10 ; also sheet 1,5
MTEN: JP8.5
N$10: 12V\.A R21.2
N$15: JP3.1
N$16: JP3.2
N$17: 9V\.A R12.2
N$26: 3.3V\.A R11.2
N$43: 5V\.A R10.2
NAS-CA: RASPBERRYPI.8 ; also sheet 3
NASPWR: RASPBERRYPI.13 ; also sheet 1
NASRX: RASPBERRYPI.9 ; also sheet 4
NASSCL: JP9.2 ; also sheet 6
NASSDA: JP9.3 ; also sheet 6
NASTX: RASPBERRYPI.10 ; also sheet 4
VIN: J4.1
Unconnected: J6.1 J6.2 J6.3 J6.4 J6.5 J8.7 JP9.1 JP9.4 JP9.5 JP9.8 JP9.9 JP9.10 JP9.11 JP9.12 JP9.13 RASPBERRYPI.1 RASPBERRYPI.2 RASPBERRYPI.3 RASPBERRYPI.4 RASPBERRYPI.5 RASPBERRYPI.6 RASPBERRYPI.7 RASPBERRYPI.12

### Notes on the sheet
- RaspberryPi
- Pin One!
- PIN26

## Library data of the parts
3.3V 5V 9V 12V = NASA_LIB:EUROMAG-2
3.3V\ 5V\ 9V\ 12V\ = SparkFun:LED: LEDs Standard schematic elements and footprints for 5mm, 3mm, 1206, and 0603 sized LEDs. 5mm - Spark Fun Electronics SKU : COM-00529 (and others)
13 EACT ELINK LED1 LED3-LED6 RX TX WIFI = adafruit:LED: LED
C1-C4 C12 C13 C23 C24 C36 = adafruit:CPOL-US: POLARIZED CAPACITOR, American symbol
C5-C7 C9 C14-C20 C27 C29-C31 C38 = adafruit:C-US: CAPACITOR, American symbol
C8 C10 C26 C28 = SparkFun:CAP_POL: Capacitor Polarized These are standard SMD and PTH capacitors. Normally 10uF, 47uF, and 100uF in electrolytic and tantalum varieties. Always verify the external diameter of the through hole cap, it varies with capacity, voltage, and manufacturer. The EIA devices should be standard.
C11 C22 C25 = resistor:C-US: CAPACITOR, American symbol
C21 C32-C35 = SparkFun:CAP: Capacitor Standard 0603 ceramic capacitor, and 0.1" leaded capacitor.
C39 = minimidi:C-US: CAPACITOR, American symbol
CG = led:LED: LED
CHG = SparkFun:SWITCH-SPST: SPST Switch Simple slide switch. Spark Fun Electronics SKU : COM-00102
CN1 = adafruit:USB: USB Connectors USBMINIB - Surface Mount Female Mini-B USB Connector 4UConnector: 06564 By microbuilder.eu Thru-hole RA Female Mini-B USB Connector 4UConnector: 18732 By ladyada.net
ETHERNET = SparkFun:M04X2
F1-F3 = adafruit:PTCFUSE: PTC fuses, resettable thermistors
H2 H4-H6 H10 = holes:MOUNT-PAD-ROUND: MOUNTING PAD, round
IC1 IC3 IC4 = ftdichip:FT232R: Source: http://www.ftdichip.com/Documents/DataSheets/DS_FT232R_v104.pdf; MPN: FT232RL; OC_FARNELL: 1146032; OC_NEWARK: 91K9918
IC2 = atmel-2005:ATMEGA*: MICROCONTROLLER 64/128/256 Kbytes FLASH 4 Kbytes EEPROM 8 Kbytes SRAM 86 General Purpose I/O pins 12-channels16-bit PWM 4 x Serial USARTs 16-channels 10-bit A/D
ICSP = pinhead:PINHD-2X3: PIN HEADER
ISP1 = adafruit:AVRISP: AVR ISP HEADER Standard 6 pin header for AVR programming
J1-J3 = NASA_LIB:EUROMAG-4
J4 = NASA_LIB:0874271042
J5-J8 = NASA_LIB:0559591630
JP1 LANNAS MCS NAS NAS3V USB = SparkFun:M03: Header 3 Standard 3-pin 0.1" header. Use with straight break away headers (SKU : PRT-00116), right angle break away headers (PRT-00553), swiss pins (PRT-00743), machine pins (PRT-00117), and female headers (PRT-00115). Molex polarized connector foot print use with SKU : PRT-08232 with associated crimp pins and housings.
JP3 JP8 = SparkFun:M05: Header 5 Standard 5-pin 0.1" header. Use with straight break away headers (SKU : PRT-00116), right angle break away headers (PRT-00553), swiss pins (PRT-00743), machine pins (PRT-00117), and female headers (PRT-00115). Molex polarized connector foot print use with SKU : PRT-08230 with associated crimp pins and housings.
JP4 JP6 JP12 = SparkFun:M02: Header 2 Standard 2-pin 0.1" header. Use with straight break away headers (SKU : PRT-00116), right angle break away headers (PRT-00553), swiss pins (PRT-00743), machine pins (PRT-00117), and female headers (PRT-00115). Molex polarized connector foot print use with SKU : PRT-08233 with associated crimp pins and housings.
JP5 = SparkFun:JUMPER-2: Jumper Basic 0.1" spaced jumper. Use with breakaway headers.
JP9 RASPBERRYPI = SparkFun:M13
JP10 JP11 JP13-JP18 = SparkFun:M04: Header 4 Standard 4-pin 0.1" header. Use with straight break away headers (SKU : PRT-00116), right angle break away headers (PRT-00553), swiss pins (PRT-00743), machine pins (PRT-00117), and female headers (PRT-00115). Molex polarized connector foot print use with SKU : PRT-08231 with associated crimp pins and housings. 1MM SMD Version SKU: PRT-10208
K1 = relay:35701331: RELAY reed, 1 x norm. open with polarity; OC_FARNELL: unknown; OC_NEWARK: unknown
L2 = rcl:L-US: INDUCTOR, American symbol
OSS X4 = adafruit:CERMOSCILL: Ceramic oscillator with built in capacitors such as ZTT-12MHz http://www.ladyada.net/library/eagle
Q1-Q14 Q16 = SparkFun:MOSFET-NCHANNEL
Q15 = SparkFun:MOSFET-PCHANNEL-SOIC8
R1 R3-R9 R15 R22-R29 R34-R43 = adafruit:R-US_: RESISTOR, American symbol
R10-R12 R21 = SparkFun:RESISTOR: Resistor Basic schematic elements and footprints for 0603, 1206, and PTH resistors.
R13 R14 R16 R17 R20 R31 R32 R44-R47 = resistor:R-US_: RESISTOR, American symbol
S1 S3 = SparkFun:TAC_SWITCH: Momentary Switch Button commonly used for reset or general input. Spark Fun Electronics SKU : COM-00097
SJ1 SJ4 SJ5 = SparkFun:SOLDERJUMPER: Solder Jumper Standard SMD solder jumper. Used to automate production. Two varients : Normally Open and Normally Closed are the same, but have different paste layers. NC will have a large amount of paste and should jumper during reflow.
SJ3 SJ6 = SparkFun:SOLDERJUMPER_2WAY: Solder Jumper 2 way solder jumper
T2 = EmEndev:NTE0505MC
U1 = NASA_LIB:LANTRONIX_A/B
U2 = adafruit:PCA9685: PCA9685 - 16 Channel 12-Bit I2C PWM Controller 5.0V tolerant 16 channel, 12-bit I2C PWM controller with 25mA per output (max. 400mA total) Digikey: 568-5931-1-ND
U3 = SparkFun:ATMEGA168
U5 U6 = NASA_LIB:IL715
U7 = SparkFun:MCP73831: Microchip's MCP73831 Miniature single cell, fully integrated Li-Ion, Li-polymer charge management controller http://ww1.microchip.com/downloads/en/DeviceDoc/21984a.pdf
U8 = NASA_LIB:SN751178
U9 = SparkFun:MAX1704X: MAX17043/MAX17044: Battery Fuel Guage (43 is 1cell, 44 is 2cell)
U10 U15 = NASA_LIB:MIC5014
U11 U13 = NASA_LIB:ADS1015
U12 = Testing:MPU-6050
U16 = NASA_LIB:CD74HC4052PWR
U20 = NASA_LIB:MAX823
U47 U49 = RJ's parts:MAX6818
U$3 = SparkFun:OSHW-LOGO: Open Source Hardware Logo This logo indicates the piece of hardware it is found on incorporates a OSHW license and/or adheres to the definition of open source hardware found here: http://freedomdefined.org/OSHW
U$16-U$19 = SparkFun:TCMT1103-OPTO
VREG = SparkFun:V_REG_LDO: Voltage Regulator LDO Standard 150mA LDO voltage regulator in SOT-23 layout. Micrel part MIC5205. BP (by-pass) pin is used to lower output noise with 470pF cap.
X1 = NASA_LIB:TLA-6T118LF

## Net classes
1 power: width 0.61 mm, drill 0.711 mm, clearance 0.203 mm